# EAGLE design v2.1 (EAGLE 8.5.1)

## Sheet 1 of 4: power
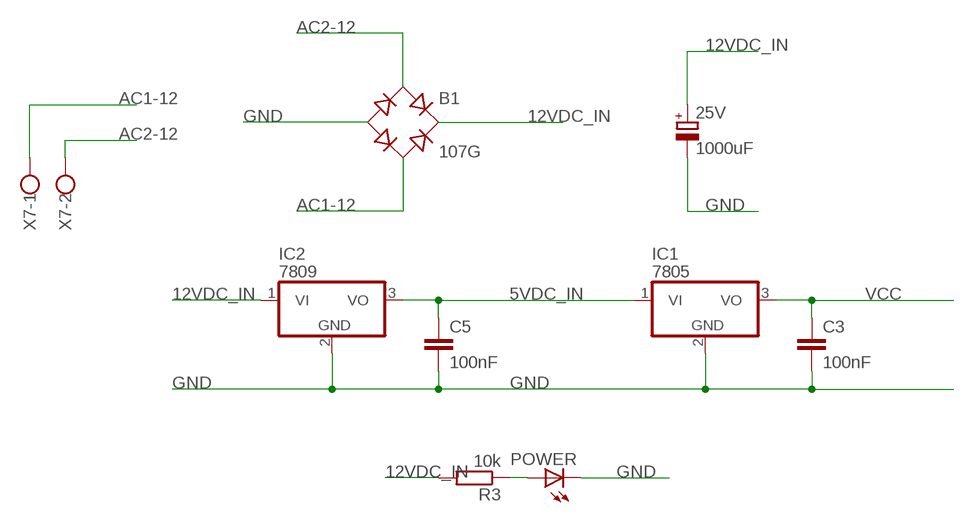
[diagram p0: schematic, sheet 1]

### Parts
25V  1000uF  CPOL-EUE3.5-8  [E3,5-8]
B1  107G  DBDB101G  [DB]
C3  100nF  C-EU050-025X075  [C050-025X075]
C5  100nF  C-EU050-025X075  [C050-025X075]
IC1  7805  7812TV  [TO220V]
IC2  7809  7812TV  [TO220V]
POWER  LED5MM  [LED5MM]
R3  10k  R-EU_0207/10  [0207/10]
X7  W237-102  [W237-102]

### Nets
5VDC_IN: C5.1 IC1.1(VI) IC2.3(VO)
12VDC_IN: 25V.+ B1.+ IC2.1(VI) R3.2 ; also sheet 4
AC1-12: B1.AC2 X7.1
AC2-12: B1.AC1 X7.2
GND: 25V.- B1.- C3.2 C5.2 IC1.2(GND) IC2.2(GND) POWER.K(C) ; also sheet 2,3,4
N$5: POWER.A R3.1
VCC: C3.1 IC1.3(VO) ; also sheet 2,3

## Sheet 2 of 4: inputs
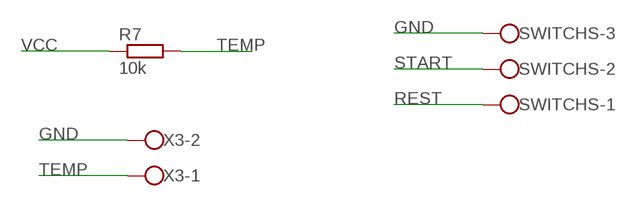
[diagram p1: schematic, sheet 2]

### Parts
R7  10k  R-EU_0207/10  [0207/10]
SWITCHS  W237-103  [W237-103]
X3  W237-102  [W237-102]

### Nets
GND: SWITCHS.3 X3.2 ; also sheet 1,3,4
REST: SWITCHS.1 ; also sheet 3
START: SWITCHS.2 ; also sheet 3
TEMP: R7.2 X3.1 ; also sheet 3
VCC: R7.1 ; also sheet 1,3

## Sheet 3 of 4: process
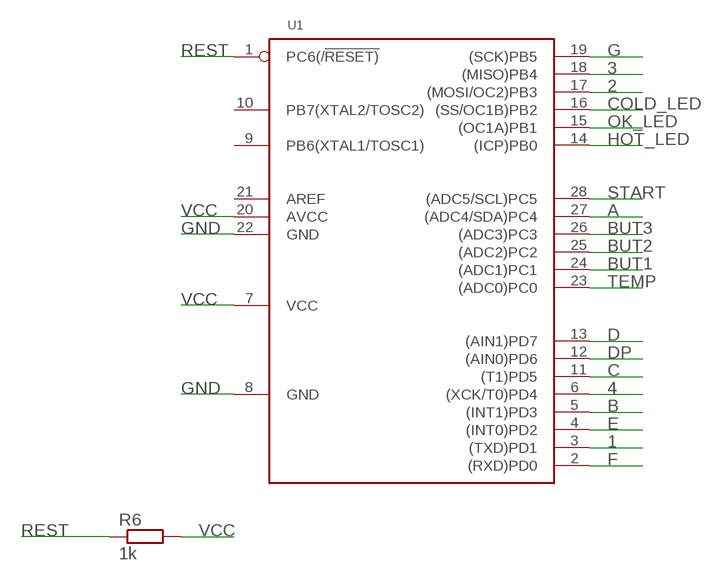
[diagram p2: schematic, sheet 3]

### Parts
R6  1k  R-EU_0207/10  [0207/10]
U1  MCU-ATMEGA328P-PU(DIP28)  [DIP28-2.54-34.7X7.62MM]

### Nets
1: U1.3((TXD)PD1)
2: U1.17((MOSI/OC2)PB3)
3: U1.18((MISO)PB4)
4: U1.6((XCK/T0)PD4)
A: U1.27((ADC4/SDA)PC4)
B: U1.5((INT1)PD3)
BUT1: U1.24((ADC1)PC1)
BUT2: U1.25((ADC2)PC2)
BUT3: U1.26((ADC3)PC3)
C: U1.11((T1)PD5)
COLD_LED: U1.16((SS/OC1B)PB2) ; also sheet 4
D: U1.13((AIN1)PD7)
DP: U1.12((AIN0)PD6)
E: U1.4((INT0)PD2)
F: U1.2((RXD)PD0)
G: U1.19((SCK)PB5)
GND: U1.8(GND) U1.22(GND) ; also sheet 1,2,4
HOT_LED: U1.14((ICP)PB0) ; also sheet 4
OK_LED: U1.15((OC1A)PB1) ; also sheet 4
REST: R6.1 U1.1(PC6(/!RESET)) ; also sheet 2
START: U1.28((ADC5/SCL)PC5) ; also sheet 2
TEMP: U1.23((ADC0)PC0) ; also sheet 2
VCC: R6.2 U1.7(VCC) U1.20(AVCC) ; also sheet 1,2
Unconnected: U1.9(PB6(XTAL1/TOSC1)) U1.10(PB7(XTAL2/TOSC2)) U1.21(AREF)

## Sheet 4 of 4: output
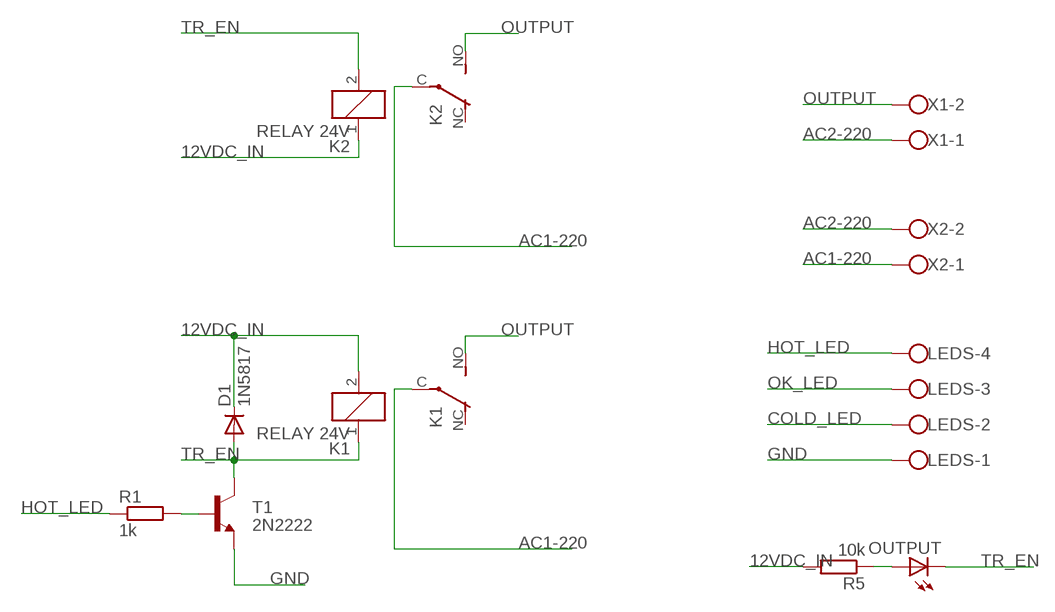
[diagram p3: schematic, sheet 4]

### Parts
D1  1N5817  1N4004  [DO41-10]
K1  RELAY 24V  JS-M1-12V-5  [JS-M]
K2  RELAY 24V  JS-M1-12V-5  [JS-M]
LEDS  W237-4  [W237-4]
OUTPUT  LED5MM  [LED5MM]
R1  1k  R-EU_0207/10  [0207/10]
R5  10k  R-EU_0207/10  [0207/10]
T1  2N2222  [TO92-EBC-OVAL]
X1  W237-102  [W237-102]
X2  W237-102  [W237-102]

### Nets
12VDC_IN: D1.C K1.2 K2.1 R5.2 ; also sheet 1
AC1-220: K1.C(2:P) K2.C(2:P) X2.1
AC2-220: X1.1 X2.2
COLD_LED: LEDS.2 ; also sheet 3
GND: LEDS.1 T1.E ; also sheet 1,2,3
HOT_LED: LEDS.4 R1.1 ; also sheet 3
N$3: OUTPUT.A R5.1
N$7: R1.2 T1.B
OK_LED: LEDS.3 ; also sheet 3
OUTPUT: K1.NO(2:S) K2.NO(2:S) X1.2
TR_EN: D1.A K1.1 K2.2 OUTPUT.K(C) T1.C
Unconnected: K1.NC(2:O) K2.NC(2:O)

## Library data of the parts
25V = rcl:CPOL-EU: POLARIZED CAPACITOR, European symbol; SPICEPREFIX: C
B1 = rectifier:DB?*G: Single Phase 1.0 AMP Glass Passivated Bridge Rectifier Taiwan Semiconductor Co.,Ltd. - TSC Source: http://www.taiwansemi.com/TSCbig5/ezcatfiles/cust/img/img/db101g.pdf http://www.ts.com.tw/db/pictures/modules/PDT/PDT060207001/DBLS201G.pdf
C3 C5 = rcl:C-EU: CAPACITOR, European symbol; SPICEPREFIX: C
D1 = adafruit:1N4004: DIODE General purpose 1N400x type rectifier (With bigger pads) http://www.ladyada.net/library/pcb/eaglelibrary.html
IC1 IC2 = linear:78*: Positive VOLTAGE REGULATOR Source: http://cache.national.com/ds/LM/LM78L05.pdf http://www.fairchildsemi.com/ds/LM/LM7805.pdf
K1 K2 = relay:JS-M1*: Automotive Ultra-Miniature Power Relay NAiS Source: http://www.mew-europe.com/.. en_ds_61211_0000.pdf; MF: FARNELL; MPN: JSM1-12V-5; OC_FARNELL: 910351; OC_NEWARK: 14J1764
LEDS = con-wago-500:W237-4: WAGO SCREW CLAMP; OC_FARNELL: unknown; OC_NEWARK: unknown
OUTPUT POWER = led:LED: LED OSRAM: - CHIPLED LG R971, LG N971, LY N971, LG Q971, LY Q971, LO R971, LY R971 LH N974, LH R974 LS Q976, LO Q976, LY Q976 LO Q996 - Hyper CHIPLED LW Q18S LB Q993, LB Q99A, LB R99A - SideLED LS A670, LO A670, LY A670, LG A670, LP A670 LB A673, LV A673, LT A673, LW A673 LH A674 LY A675 LS A676, LA A676, LO A676, LY A676, LW A676 LS A679, LY A679, LG A679 - Hyper Micro SIDELED® LS Y876, LA Y876, LO Y876, LY Y876 LT Y87S - SmartLED LW L88C, LW L88S LB L89C, LB L89S, LG L890 LS L89K, LO L89K, LY L89K LS L896, LA L896, LO L896, LY L896 - TOPLED LS T670, LO T670, LY T670, LG T670, LP T670 LSG T670, LSP T670, LSY T670, LOP T670, LYG T670 LG T671, LOG T671, LSG T671 LB T673, LV T673, LT T673, LW T673 LH T674 LS T676, LA T676, LO T676, LY T676, LB T676, LH T676, LSB T676, LW T676 LB T67C, LV T67C, LT T67C, LS T67K, LO T67K, LY T67K, LW E67C LS E67B, LA E67B, LO E67B, LY E67B, LB E67C, LV E67C, LT E67C LW T67C LS T679, LY T679, LG T679 LS T770, LO T770, LY T770, LG T770, LP T770 LB T773, LV T773, LT T773, LW T773 LH T774 LS E675, LA E675, LY E675, LS T675 LS T776, LA T776, LO T776, LY T776, LB T776 LHGB T686 LT T68C, LB T68C - Hyper Mini TOPLED® LB M676 - Mini TOPLED Santana® LG M470 LS M47K, LO M47K, LY M47K Source: http://www.osram.convergy.de/
R1 R3 R5-R7 = rcl-2:R-EU_: RESISTOR, European symbol
SWITCHS = con-wago-500:W237-103: WAGO SCREW CLAMP
T1 = adafruit:2N2222: NPN TRANSISTOR Big oval pads
U1 = Seeed-IC:MCU-ATMEGA328P-PU(DIP28): 310010051; MPN: ATMEGA328P-PU
X1-X3 X7 = con-wago-500:W237-102: WAGO SCREW CLAMP

## Board
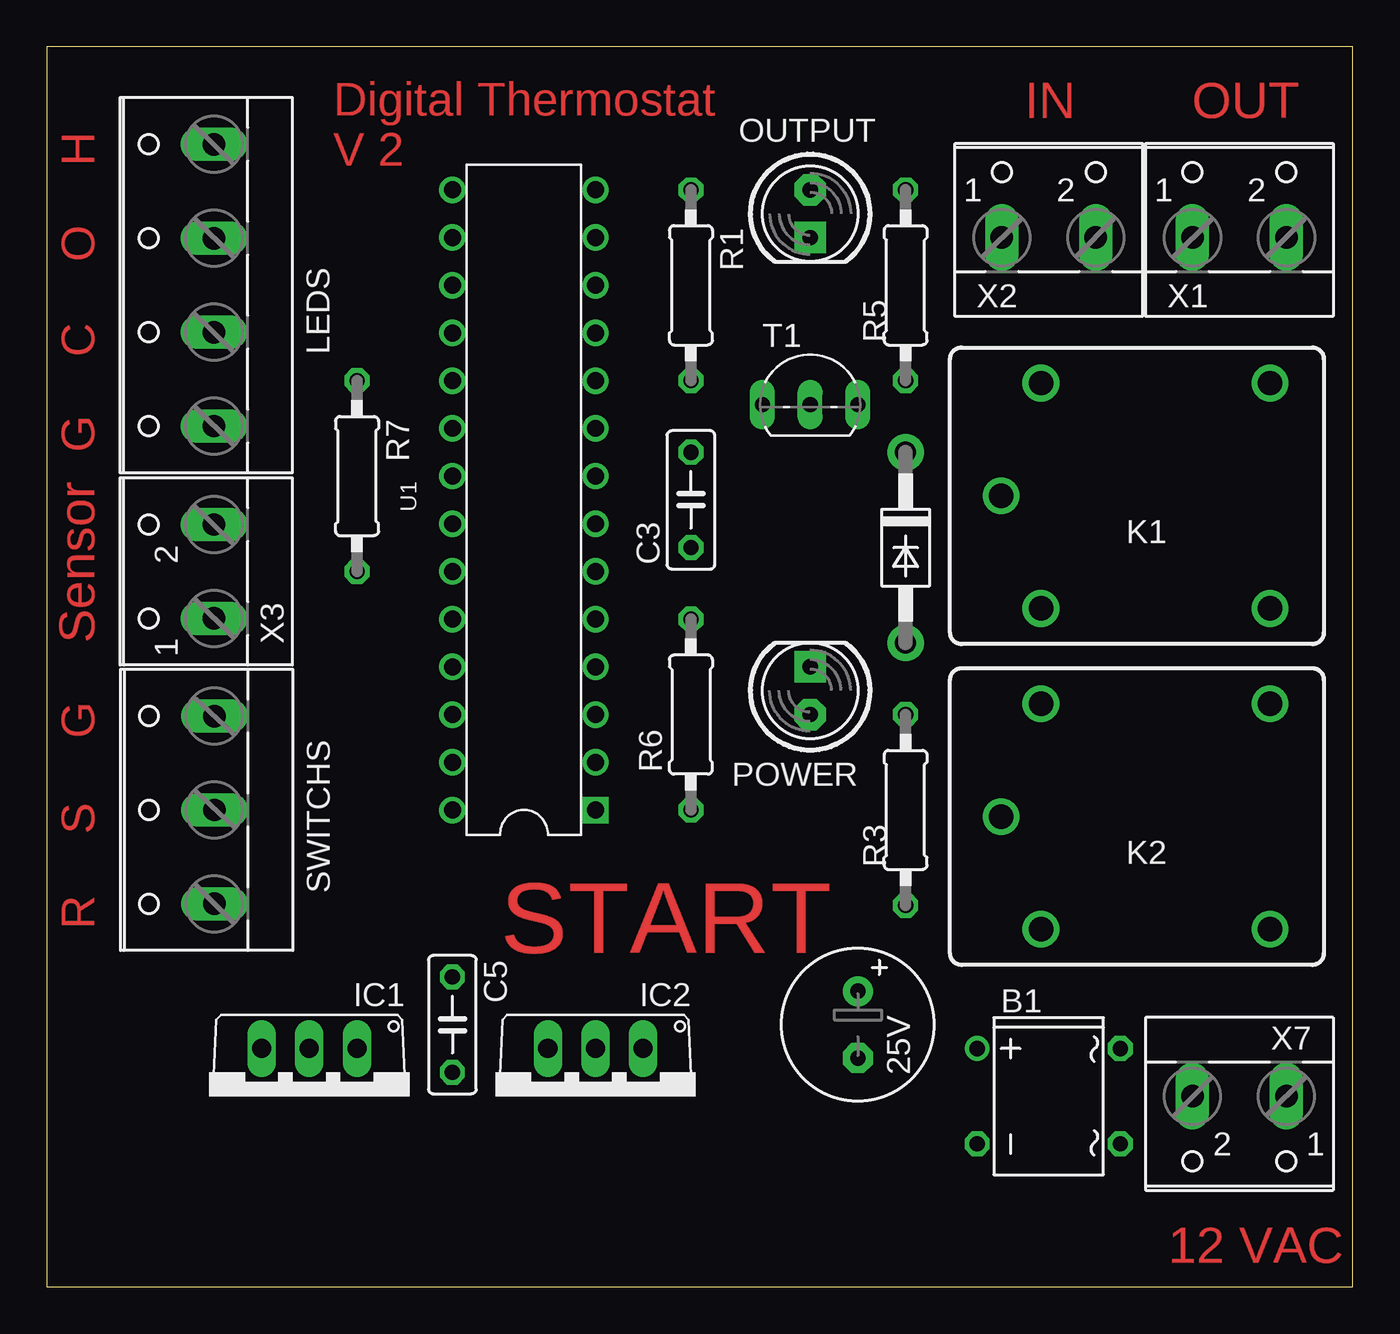
[diagram p4: board, top side]
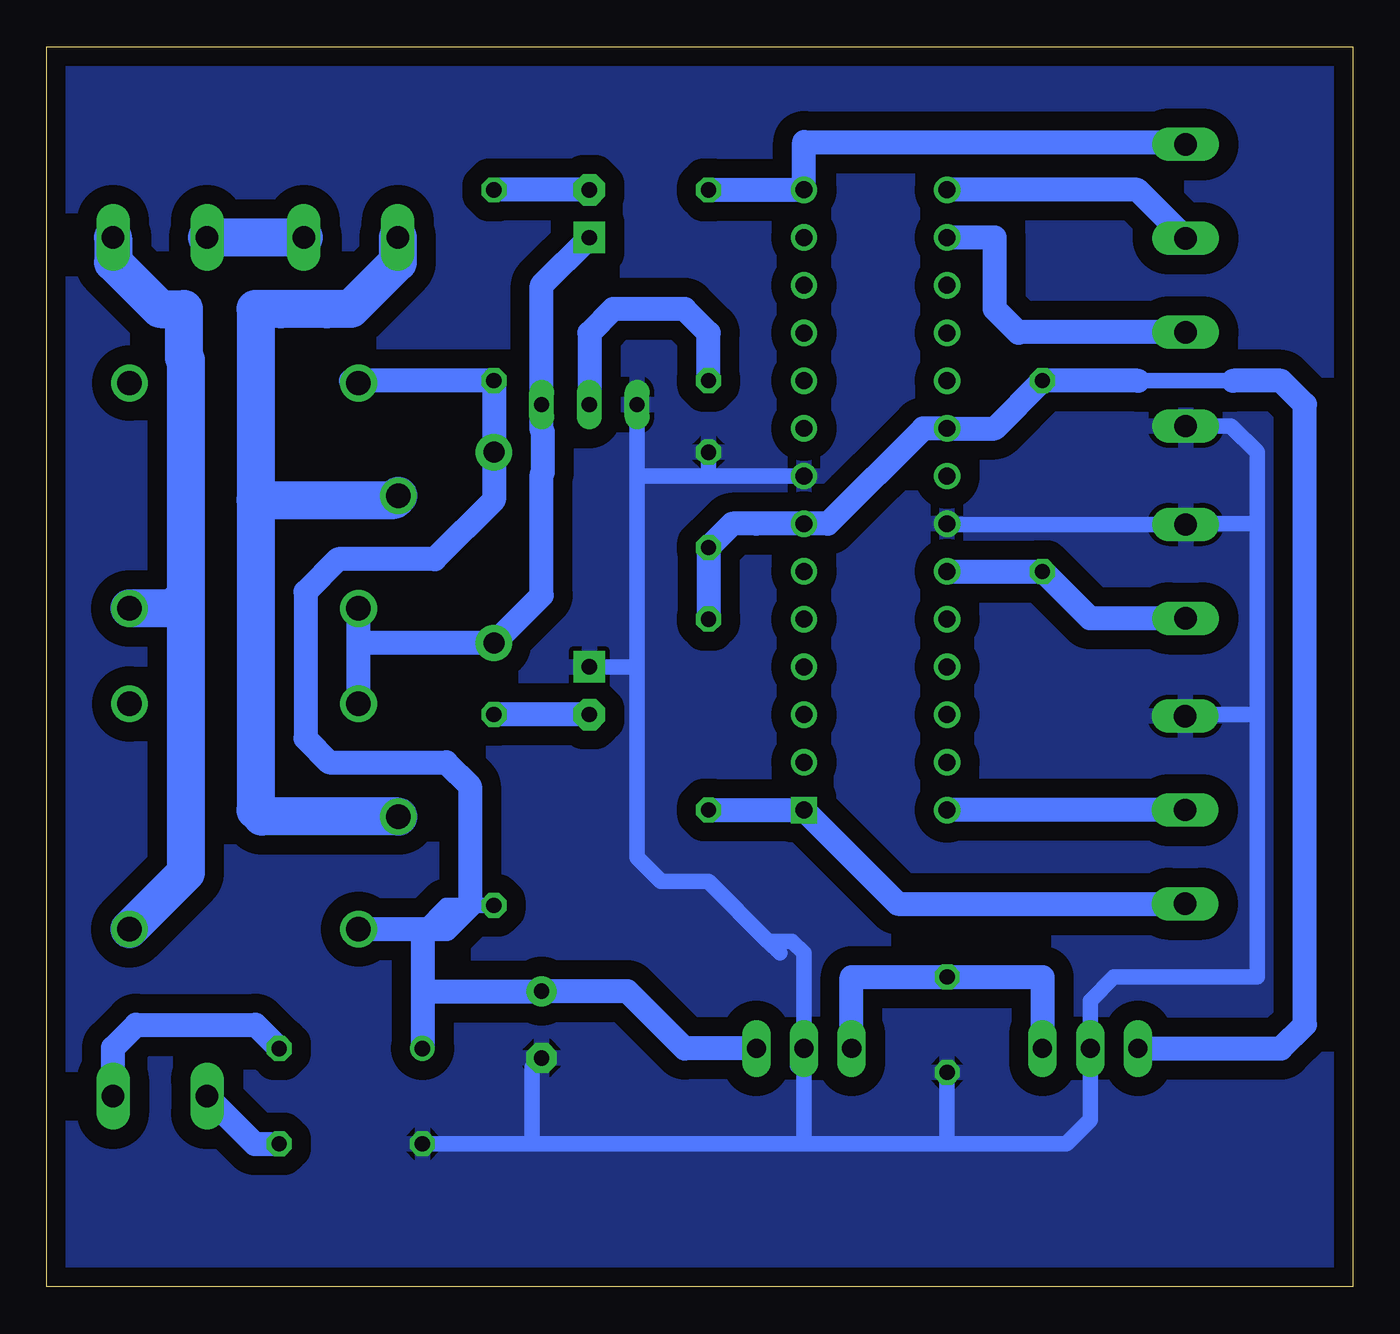
[diagram p5: board, bottom side, seen from below]

Size 69.52 x 66.03 mm. Coordinates in mm from the lower left corner, seen from the top.
Outline: 0,0 69.52,0 69.52,66.03 0,66.03 0,0
Copper layers (1*16): Top 0.035mm / dielectric 1.5mm / Bottom 0.035mm
Design rules "default *": minimum track width 25mil, minimum drill 0.35mm, track to track 40mil, track to pad 40mil, pad to pad 6mil, via to via 6mil, smd to smd 6mil, copper to edge 40mil, drill to drill 6mil, minimum pad ring 10mil, minimum via ring 8mil, stop-mask expansion 4mil, vias tented up to drill 0mil, thermal gap 10mil

### Footprints (pad centres in the part's own frame; a part is rotated, then mirrored left to right if it is on the bottom)
E3,5-8 = drill 0.813 pad 1.6: + -1.778,0 | drill 0.813 pad 1.6 octagon: - 1.778,0
DB = drill 0.813: + -2.54,-3.81 | drill 0.813 octagon: - 2.54,-3.81; AC1 2.54,3.81; AC2 -2.54,3.81
C050-025X075 = drill 0.813 octagon: 1 -2.54,0; 2 2.54,0
DO41-10 = drill 1.118 pad 1.93: A 5.08,0; C -5.08,0
TO220V = drill 1.016 long: 1 -2.54,-2.54; 2 0,-2.54; 3 2.54,-2.54
JS-M = drill 1.3: 1 6.7,6; 2 6.7,-6; C 8.827,0; NC -5.5,-6; NO -5.5,6
W237-4 = drill 1.194 long: 1 -7.5,-1.27; 2 -2.5,-1.27; 3 2.5,-1.27; 4 7.5,-1.27
LED5MM = drill 0.813 pad 1.676 octagon: A -1.27,0 | drill 0.813 pad 1.676 square: K 1.27,0
0207/10 = drill 0.813 octagon: 1 -5.08,0; 2 5.08,0
W237-103 = drill 1.194 long: 1 -5,-1.29; 2 0,-1.29; 3 5,-1.29
TO92-EBC-OVAL = drill 0.813 long: B 0,-1.27; C 2.54,-1.27; E -2.54,-1.27
DIP28-2.54-34.7X7.62MM = drill 0.9 pad 1.4 square: 1 -16.51,-3.81 | drill 0.9 pad 1.4: 2 -13.97,-3.81; 3 -11.43,-3.81; 4 -8.89,-3.81; 5 -6.35,-3.81; 6 -3.81,-3.81; 7 -1.27,-3.81; 8 1.27,-3.81; 9 3.81,-3.81; 10 6.35,-3.81; 11 8.89,-3.81; 12 11.43,-3.81; 13 13.97,-3.81; 14 16.51,-3.81; 15 16.51,3.81; 16 13.97,3.81; 17 11.43,3.81; 18 8.89,3.81; 19 6.35,3.81; 20 3.81,3.81; 21 1.27,3.81; 22 -1.27,3.81; 23 -3.81,3.81; 24 -6.35,3.81; 25 -8.89,3.81; 26 -11.43,3.81; 27 -13.97,3.81; 28 -16.51,3.81
W237-102 = drill 1.194 long: 1 -2.5,-1.27; 2 2.5,-1.27

### Placement (x,y rotation side)
25V  43.18,13.97 270 top
B1  53.34,10.16 270 top
C3  34.29,41.91 90 top
C5  21.59,13.97 270 top
D1  45.72,39.37 270 top
IC1  13.97,10.16 180 top
IC2  29.21,10.16 180 top
K1  59.63,42.13 180 top
K2  59.63,25.05 180 top
LEDS  7.62,53.34 90 top
OUTPUT  40.64,57.15 270 top
POWER  40.64,31.75 90 top
R1  34.29,53.34 270 top
R3  45.72,25.4 270 top
R5  45.72,53.34 270 top
R6  34.29,30.48 90 top
R7  16.51,43.18 270 top
SWITCHS  7.62,25.4 90 top
T1  40.64,48.26 0 top
U1  25.4,41.91 90 top
X1  63.5,57.15 0 top
X2  53.34,57.15 0 top
X3  7.62,38.1 90 top
X7  63.5,8.89 180 top

### Tracks (layer width: path | path; a pad name or v marks a point on that pad's centre or on a via)
5VDC_IN
  Bottom 0.813: 16.51,16.51 C5.1 26.67,16.51
  Bottom 1.27: IC2.3 26.67,16.51 16.51,16.51 IC1.1
12VDC_IN
  Bottom 0.813: B1.+ 49.53,15.24 | 49.53,15.24 49.53,19.05 | 49.53,19.05 K2.1 | 49.53,19.05 48.26,20.32 46.99,20.32 R3.2 | 48.26,27.94 54.61,27.94 55.88,29.21 | K1.2 45.85,48.13 R5.2 | 49.53,15.24 49.02,15.75
  Bottom 1.27: K2.1 48.26,19.05 46.99,20.32 46.99,26.67 48.26,27.94 54.48,27.94 55.75,29.21 55.75,37.02 54.02,38.76 48.87,38.76 45.72,41.91 D1.C R5.2 53.34,48.26 | 49.53,19.05 B1.+ | 49.02,15.75 25V.+ 38.61,15.75 35.56,12.7 IC2.1
AC1-12
  Bottom 1.27: B1.AC2 58.42,13.97 64.77,13.97 66,12.74 X7.1
AC1-220
  Bottom 2.032: X2.1 50.84,54.57 53.34,52.07 54.62,52.07 54.63,52.06 57.05,52.06 57.06,52.07 58.42,52.07 58.42,41.91 | 58.42,41.91 58.42,25.4 58.07,25.05 K2.C | 58.42,41.91 51.02,41.91 K1.C
AC2-12
  Bottom 1.27: X7.2 58.46,7.62 B1.AC1
AC2-220
  Bottom 2.032: X2.2 X1.1
COLD_LED
  Bottom 1.27: LEDS.2 17.74,50.84 17.78,50.8 19.05,52.07 19.05,55.88 U1.16
GND
  Bottom 0.813: 38.1,43.18 T1.E | 38.1,43.18 34.29,43.18 | 34.29,43.18 U1.8 | C3.2 34.29,43.18 | SWITCHS.3 8.83,30.48 5.08,30.48 | LEDS.1 6.47,45.84 5.08,44.45 5.08,40.64 | 5.08,40.64 8.85,40.64 X3.2 21.55,40.6 U1.22 | 5.08,30.48 5.08,16.51 12.7,16.51 13.97,15.24 IC1.2 13.97,8.89 15.24,7.62 21.59,7.62 | 5.08,30.48 5.08,40.64 | C5.2 21.59,7.62 | 43.69,7.62 29.21,7.62 | 29.21,7.62 21.59,7.62 | B1.- 43.69,7.62 | IC2.2 29.21,7.62 | IC2.2 29.57,11.79 29.57,13.1 | 30.48,17.78 31.11,18.41 | 31.11,18.41 34.29,21.59 36.83,21.59 38.1,22.86 38.1,33.02 | 38.1,33.02 38.1,43.18 | POWER.K 38.1,33.02 | IC2.2 29.21,17.78 29.84,18.41 31.11,18.41 | 25V.- 43.69,11.68 43.69,7.62
  pour Bottom: -1.27,66.04 68.58,66.04 69.85,64.77 69.85,1.27 68.58,0 -1.27,0
HOT_LED
  Bottom 0.813: 9.01,60.96 LEDS.4
  Bottom 1.27: R1.1 U1.14 29.21,60.96 9.01,60.96
N$3
  Bottom 1.27: OUTPUT.A R5.1
N$5
  Bottom 1.27: POWER.A R3.1
N$7
  Bottom 1.27: R1.2 34.29,50.8 35.56,52.07 39.37,52.07 40.64,50.8 T1.B
OK_LED
  Bottom 0.813: LEDS.3 10.12,55.84
  Bottom 1.27: LEDS.3 11.47,58.42 U1.15
OUTPUT
  Bottom 1.27: X1.2 66,55.84 | 62.23,52.07 62.23,35.56 | 62.23,35.56 62.23,21.95 | K1.NO 62.8,36.13 62.23,35.56
  Bottom 2.032: X1.2 66,54.57 63.5,52.07 62.23,52.07 62.23,49.49 62.12,49.38 62.12,36.83 | K2.NO 62.23,21.95 62.12,22.06 62.12,36.83 | 62.12,36.83 62.82,36.13 K1.NO
REST
  Bottom 1.27: R6.1 U1.1 24.21,20.4 SWITCHS.1
START
  Bottom 1.27: SWITCHS.2 U1.28
TEMP
  Bottom 1.27: U1.23 R7.2 16.47,38.1 13.97,35.6 X3.1
TR_EN
  Bottom 1.27: OUTPUT.K 43.18,53.34 T1.C 43.18,45.61 43.1,45.53 43.1,43.37 43.18,43.29 43.18,36.83 D1.A 52.93,34.29 | K2.2 52.93,34.29 | 52.93,34.29 K1.1
VCC
  Bottom 0.813: 6.35,48.26 11.43,48.26 | 31.75,40.64 U1.7 27.94,40.64
  Bottom 1.27: IC1.3 3.81,12.7 2.54,13.97 2.54,46.99 3.81,48.26 6.35,48.26 | 11.43,48.26 R7.1 19.05,45.72 U1.20 22.86,45.72 27.94,40.64 31.75,40.64 33.02,40.64 C3.1 R6.2

### Text on the board
Top: IN | OUT | H | Digital Thermostat | V 2 | O | C | G | Sensor | G | S | R | START | 12 VAC